# Altium schematic sheet DRV8840_driver.SchDoc: Motor Driver
size A; DocumentNumber: 2; SheetNumber: 2; SheetTotal: 5
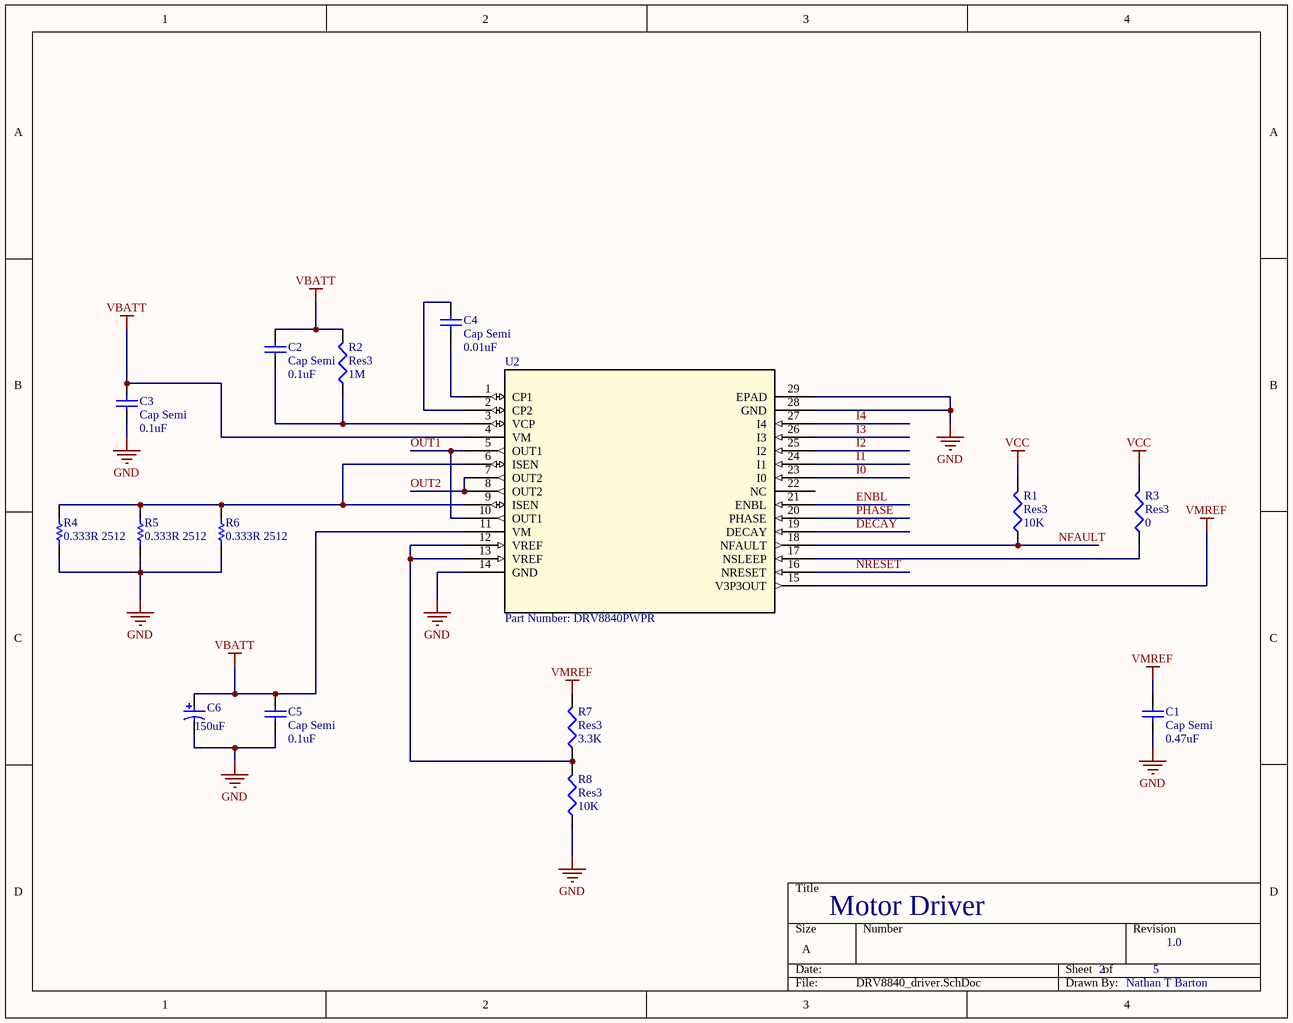
[diagram p0: DRV8840_driver.SchDoc]

## Parts
C1  Cap Semi  value 0.47uF  [C1206]
C2  Cap Semi  value 0.1uF  [C1206]
C3  Cap Semi  value 0.1uF  [C1206]
C4  Cap Semi  value 0.01uF  [C1206]
C5  Cap Semi  value 0.1uF  [C1206]
C6  150uF  [NIC-CAPA2-10X10_V]
R1  Res3  value 10K  [J1-0603]
R2  Res3  value 1M  [J1-0603]
R3  Res3  value 0  [J1-0603]
R4  0.333R 2512  [RESC2512(6432)_M]
R5  0.333R 2512  [RESC2512(6432)_M]
R6  0.333R 2512  [RESC2512(6432)_M]
R7  Res3  value 3.3K  [J1-0603]
R8  Res3  value 10K  [J1-0603]
U2  Part Number: DRV8840PWPR  [PWP28_5P18X3P1]

## Nets
GND: C1.1 C3.1 C5.1 C6.2 R4.1 R5.1 R6.1 R8.1 U2.14(GND) U2.28(GND) U2.29(EPAD)
VBATT: C2.2 C3.2 C5.2 C6.1 R2.2 U2.4(VM) U2.11(VM)
VCC: R1.2 R3.2
VMREF: C1.2 R7.2 U2.15(V3P3OUT)
DECAY: U2.19(DECAY)
ENBL: U2.21(ENBL)
I0: U2.23(I0)
I1: U2.24(I1)
I2: U2.25(I2)
I3: U2.26(I3)
I4: U2.27(I4)
NFAULT: R1.1 U2.18(NFAULT)
NRESET: U2.16(NRESET)
OUT1: U2.5(OUT1) U2.10(OUT1)
OUT2: U2.7(OUT2) U2.8(OUT2)
PHASE: U2.20(PHASE)
NetC2_1: C2.1 R2.1 U2.3(VCP)
NetC4_1: C4.1 U2.1(CP1)
NetC4_2: C4.2 U2.2(CP2)
NetR3_1: R3.1 U2.17(NSLEEP)
NetR4_2: R4.2 R5.2 R6.2 U2.6(ISEN) U2.9(ISEN)
NetR7_1: R7.1 R8.2 U2.12(VREF) U2.13(VREF)

Not connected (* = marked no-connect by the designer): U2 22(NC)

## Notes on the sheet
- Motor Driver
- 2
- 5
- 1.0
- Nathan T Barton

## Library data of the parts
C1-C5 = Cap Semi: Capacitor (Semiconductor SIM Model); Published: 8-Jun-2000; LatestRevisionDate: 29-May-2009; LatestRevisionNote: IPC-7351 Footprint Added.; PackageReference: C1206; Publisher: Altium Limited; PackageDescription: Chip Capacitor
C6 = CMP-0687-00003-1: Aluminum Electrolytic Capacitor, UD Series, Low Impedance, 150 uF, 50 V, + / - 20%, -55 to 105 degC, Chip Type, 10 x 10 mm D x L, Pb-Free, Reel; Manufacturer: Nichicon; PartNumber: UUD1H151MNL1GS; Rated Ripple Current (at 100kHz): 670 mA; Impedance: 0.18 Ohm; Packing: Dia382mm Reel; Tolerance Rated Capacitance: -20 to 20%; Rated Voltage: 50 V; Endurance Time: 5000 h; ComponentLink3URL: http://products.nichicon.co.jp/en/pdf/XJA043/e-ud.pdf; ComponentLink1URL: http://www.nichicon.co.jp/; ComponentLink2Description: Datasheet; Diameter: 10 mm; Rated Capacitance: 150 uF; ComponentLink3Description: Package Specification; PackageDescription: 2-Pin Surface Mount Device, Diameter 10 mm, Height 10 mm, Pitch 8 mm; ComponentLink1Description: Manufacturer URL; DatasheetVersion: 08/2012; Length: 10 mm; PackageReference: CAPAE-D10H10; RoHS: TRUE; Mounting Technology: Surface Mount; ComponentLink2URL: http://products.nichicon.co.jp/en/pdf/XJA043/e-ud.pdf
R1-R3 R7 R8 = Res3: Resistor; Published: 8-Jun-2000; LatestRevisionDate: 29-May-2009; LatestRevisionNote: IPC-7351 Footprint Added.; PackageReference: J1-0603; Publisher: Altium Limited; PackageDescription: Chip Resistor
R4-R6 = CMP-1018-00171-1: 1R 1W 1% 2512 (6432 Metric)  SMD; Case-EIA: 2512; Value: 1.00 Ohm; Case-Metric: 6432; Tolerance: 1 %; Technology: SMT; Power: 1 W
U2 = DRV8840PWPR: No Description Available; Manufacturer: Texas Instruments; Built_By: EMA_UL_Team; Vendor: Texas Instruments; Manufacturer_Part_Number: DRV8840PWPR; Copyright: Copyright (C) 2018 Accelerated Designs. All rights reserved; RefDes: RefDes; Type: DEV; Value: Value